# EasyEDA schematic Frozen Slimes v2 BMI.json
TITLE: Sheet_1; REV: 1.0; Date: 2023-01-04; Sheet: 1/1; Company: Your Company
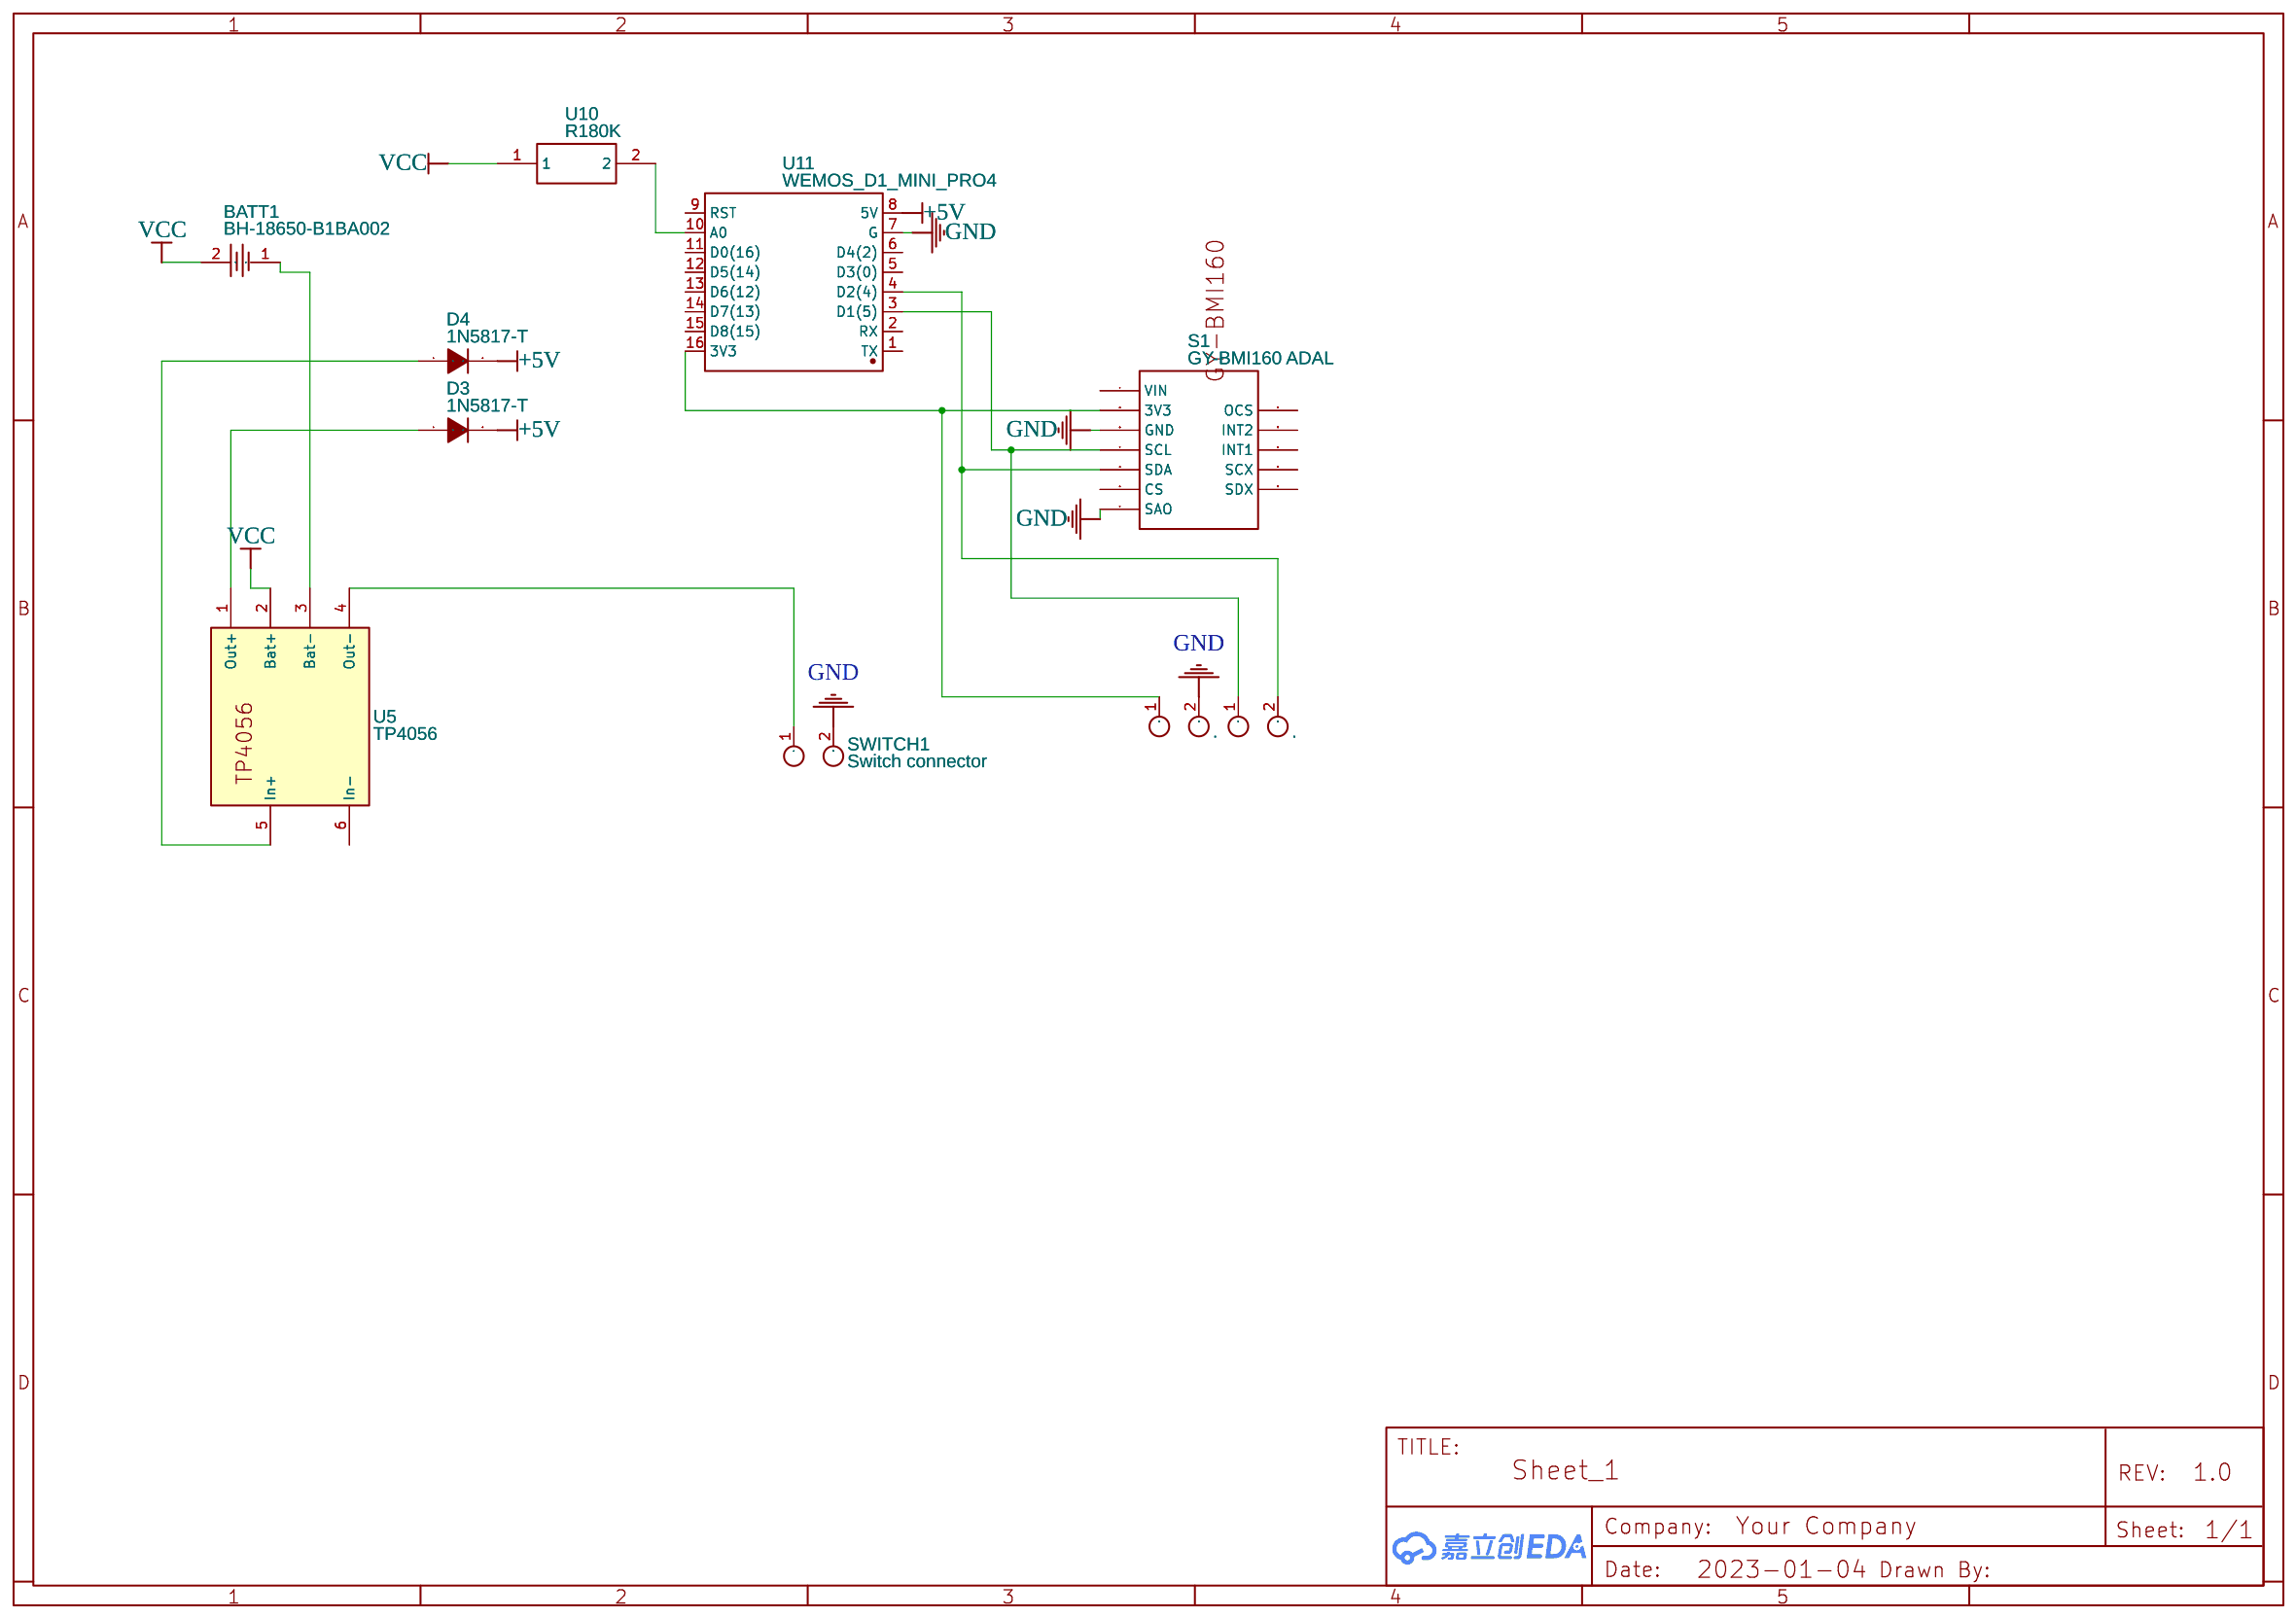
[diagram p0: schematic sheet]

## Parts
BATT1  BH-18650-B1BA002  [BATTERY-SMD_18650-1S-L77.1-W20.7-1]
D3  1N5817-T  [DO-41_BD2.4-L4.7-P8.70-D0.9-FD]
D4  1N5817-T  [DO-41_BD2.4-L4.7-P8.70-D0.9-FD]
S1  GY-BMI160 ADAL  [GY-BMI160 ADAL]
SWITCH1  Switch connector  [2XSOLDERPAD]
U5  TP4056  [TP4056]
U8  .  [2XSOLDERPAD]
U9  .  [2XSOLDERPAD]
U10  R180K  [ER RESISTOR 180K/0.6 W]
U11  WEMOS_D1_MINI_PRO4  [DIP-16_WEMOS_D1_MINI_PRO4]

## Library data of the parts
BATT1 = BH-18650-B1BA002: Supplier: LCSC; Supplier Part: C2988620; Manufacturer: MYOUNG(美阳); link: https://atta.szlcsc.com/upload/public/pdf/source/20220402/870DB99AB50CA0DF8D51CF7C86A51FAB.pdf; Contributor: lcsc; JLCPCB Part Class: Extended Part
D3 D4 = 1N5817-T: Supplier: LCSC; Supplier Part: C507852; Manufacturer: DIODES(美台); Contributor: LCSC; JLCPCB Part Class: Extended Part
S1 = GY-BMI160 ADAL: Supplier: Banggood; Contributor: adal
SWITCH1 U8 U9 = 2XSOLDER PAD: Contributor: matt_2969
U5 = TP4056: Contributor: defdjamel2008
U10 = R180K: Contributor: Witlon
U11 = WEMOS_D1_MINI_PRO4: Supplier: LCSC; Supplier Part: C2837266; Manufacturer: null; Manufacturer Part: Wemos_D1_mini_Pro4; Contributor: LCSC; JLCPCB Part Class: Extended Part

## Nets
+5V: D3.2(K) D4.2(K) U11.8(5V)
GND: S1.1(SAO) S1.5(GND) SWITCH1.2 U9.2 U11.7(G)
VCC: BATT1.2 U5.2(Bat+) U10.1
Net-(BATT1-1): BATT1.1 U5.3(Bat-)
Net-(D3-1): D3.1(A) U5.1(Out+)
Net-(D4-1): D4.1(A) U5.5(In+)
Net-(S1-3): S1.3(SDA) U8.2 U11.4(D2(4))
Net-(S1-4): S1.4(SCL) U8.1 U11.3(D1(5))
Net-(S1-6): S1.6(3V3) U9.1 U11.16(3V3)
Net-(SWITCH1-1): SWITCH1.1 U5.4(Out-)
Net-(U10-2): U10.2 U11.10(A0)

Not connected (* = marked no-connect by the designer): S1 2(CS) 7(VIN) 8(OCS) 9(INT2) 10(INT1) 11(SCX) 12(SDX); U5 6(In-); U11 1(TX) 2(RX) 5(D3(0)) 6(D4(2)) 9(RST) 11(D0(16)) 12(D5(14)) 13(D6(12)) 14(D7(13)) 15(D8(15))
